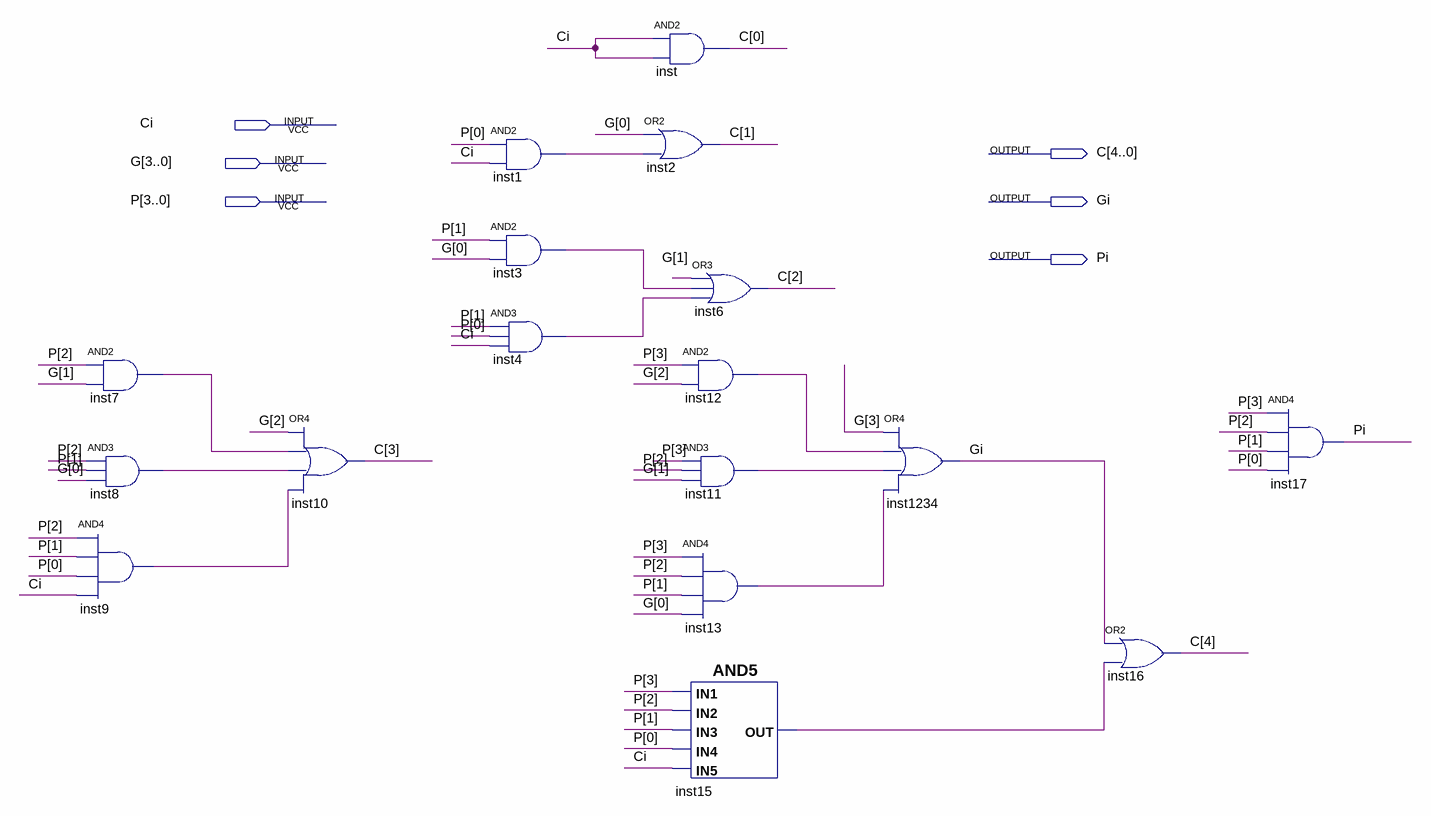
[diagram p0: schematic sheet]
// Quartus schematic cg4.bdf as structural Verilog: 17 symbols, 6 pins
module cg4 (
  input  Ci,
  input  [3:0] G,
  input  [3:0] P,
  output [4:0] C,
  output Gi,
  output Pi
);

  wire inst1_out, inst3_out, inst4_out, inst7_out, inst8_out, inst9_out, inst11_out, inst12_out, inst13_out,
       inst15_out;

  and inst7 (inst7_out, P[2], G[1]);
  and inst8 (inst8_out, P[2], P[1], G[0]);
  and inst9 (inst9_out, P[2], P[1], P[0], Ci);
  or inst10 (C[3], G[2], inst7_out, inst8_out, inst9_out);
  and inst1 (inst1_out, P[0], Ci);
  and inst3 (inst3_out, P[1], G[0]);
  and inst4 (inst4_out, P[1], P[0], Ci);
  and inst (C[0], Ci, Ci);
  or inst2 (C[1], G[0], inst1_out);
  or inst6 (C[2], G[1], inst3_out, inst4_out);
  and inst12 (inst12_out, P[3], G[2]);
  and inst11 (inst11_out, P[3], P[2], G[1]);
  and inst13 (inst13_out, P[3], P[2], P[1], G[0]);
  and inst15 (inst15_out, P[3], P[2], P[1], P[0], Ci);
  or inst1234 (Gi, G[3], inst12_out, inst11_out, inst13_out);
  or inst16 (C[4], Gi, inst15_out);
  and inst17 (Pi, P[3], P[2], P[1], P[0]);
endmodule
